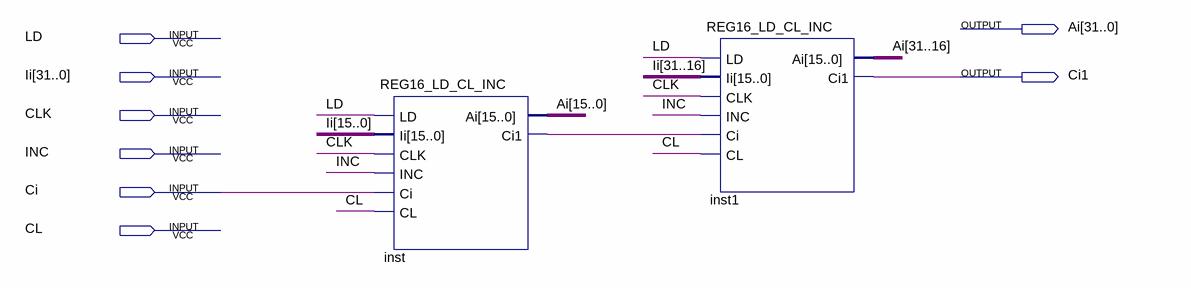
[diagram p0: schematic sheet]
// Quartus schematic REG32_LD_CL_INC.bdf as structural Verilog: 2 symbols, 8 pins
module REG32_LD_CL_INC (
  input  LD,
  input  [31:0] Ii,
  input  CLK,
  input  INC,
  input  Ci,
  input  CL,
  output [31:0] Ai,
  output Ci1
);

  wire inst_ci1;

  REG16_LD_CL_INC inst (.LD(LD), .Ii(Ii[15:0]), .CLK(CLK), .INC(INC), .Ci(Ci), .CL(CL), .Ai(Ai[15:0]), .Ci1(inst_ci1));
  REG16_LD_CL_INC inst1 (
    .LD(LD), .Ii(Ii[31:16]), .CLK(CLK), .INC(INC), .Ci(inst_ci1), .CL(CL), .Ai(Ai[31:16]), .Ci1(Ci1));
endmodule
